# EAGLE design stm32_mather (EAGLE 9.6.2)
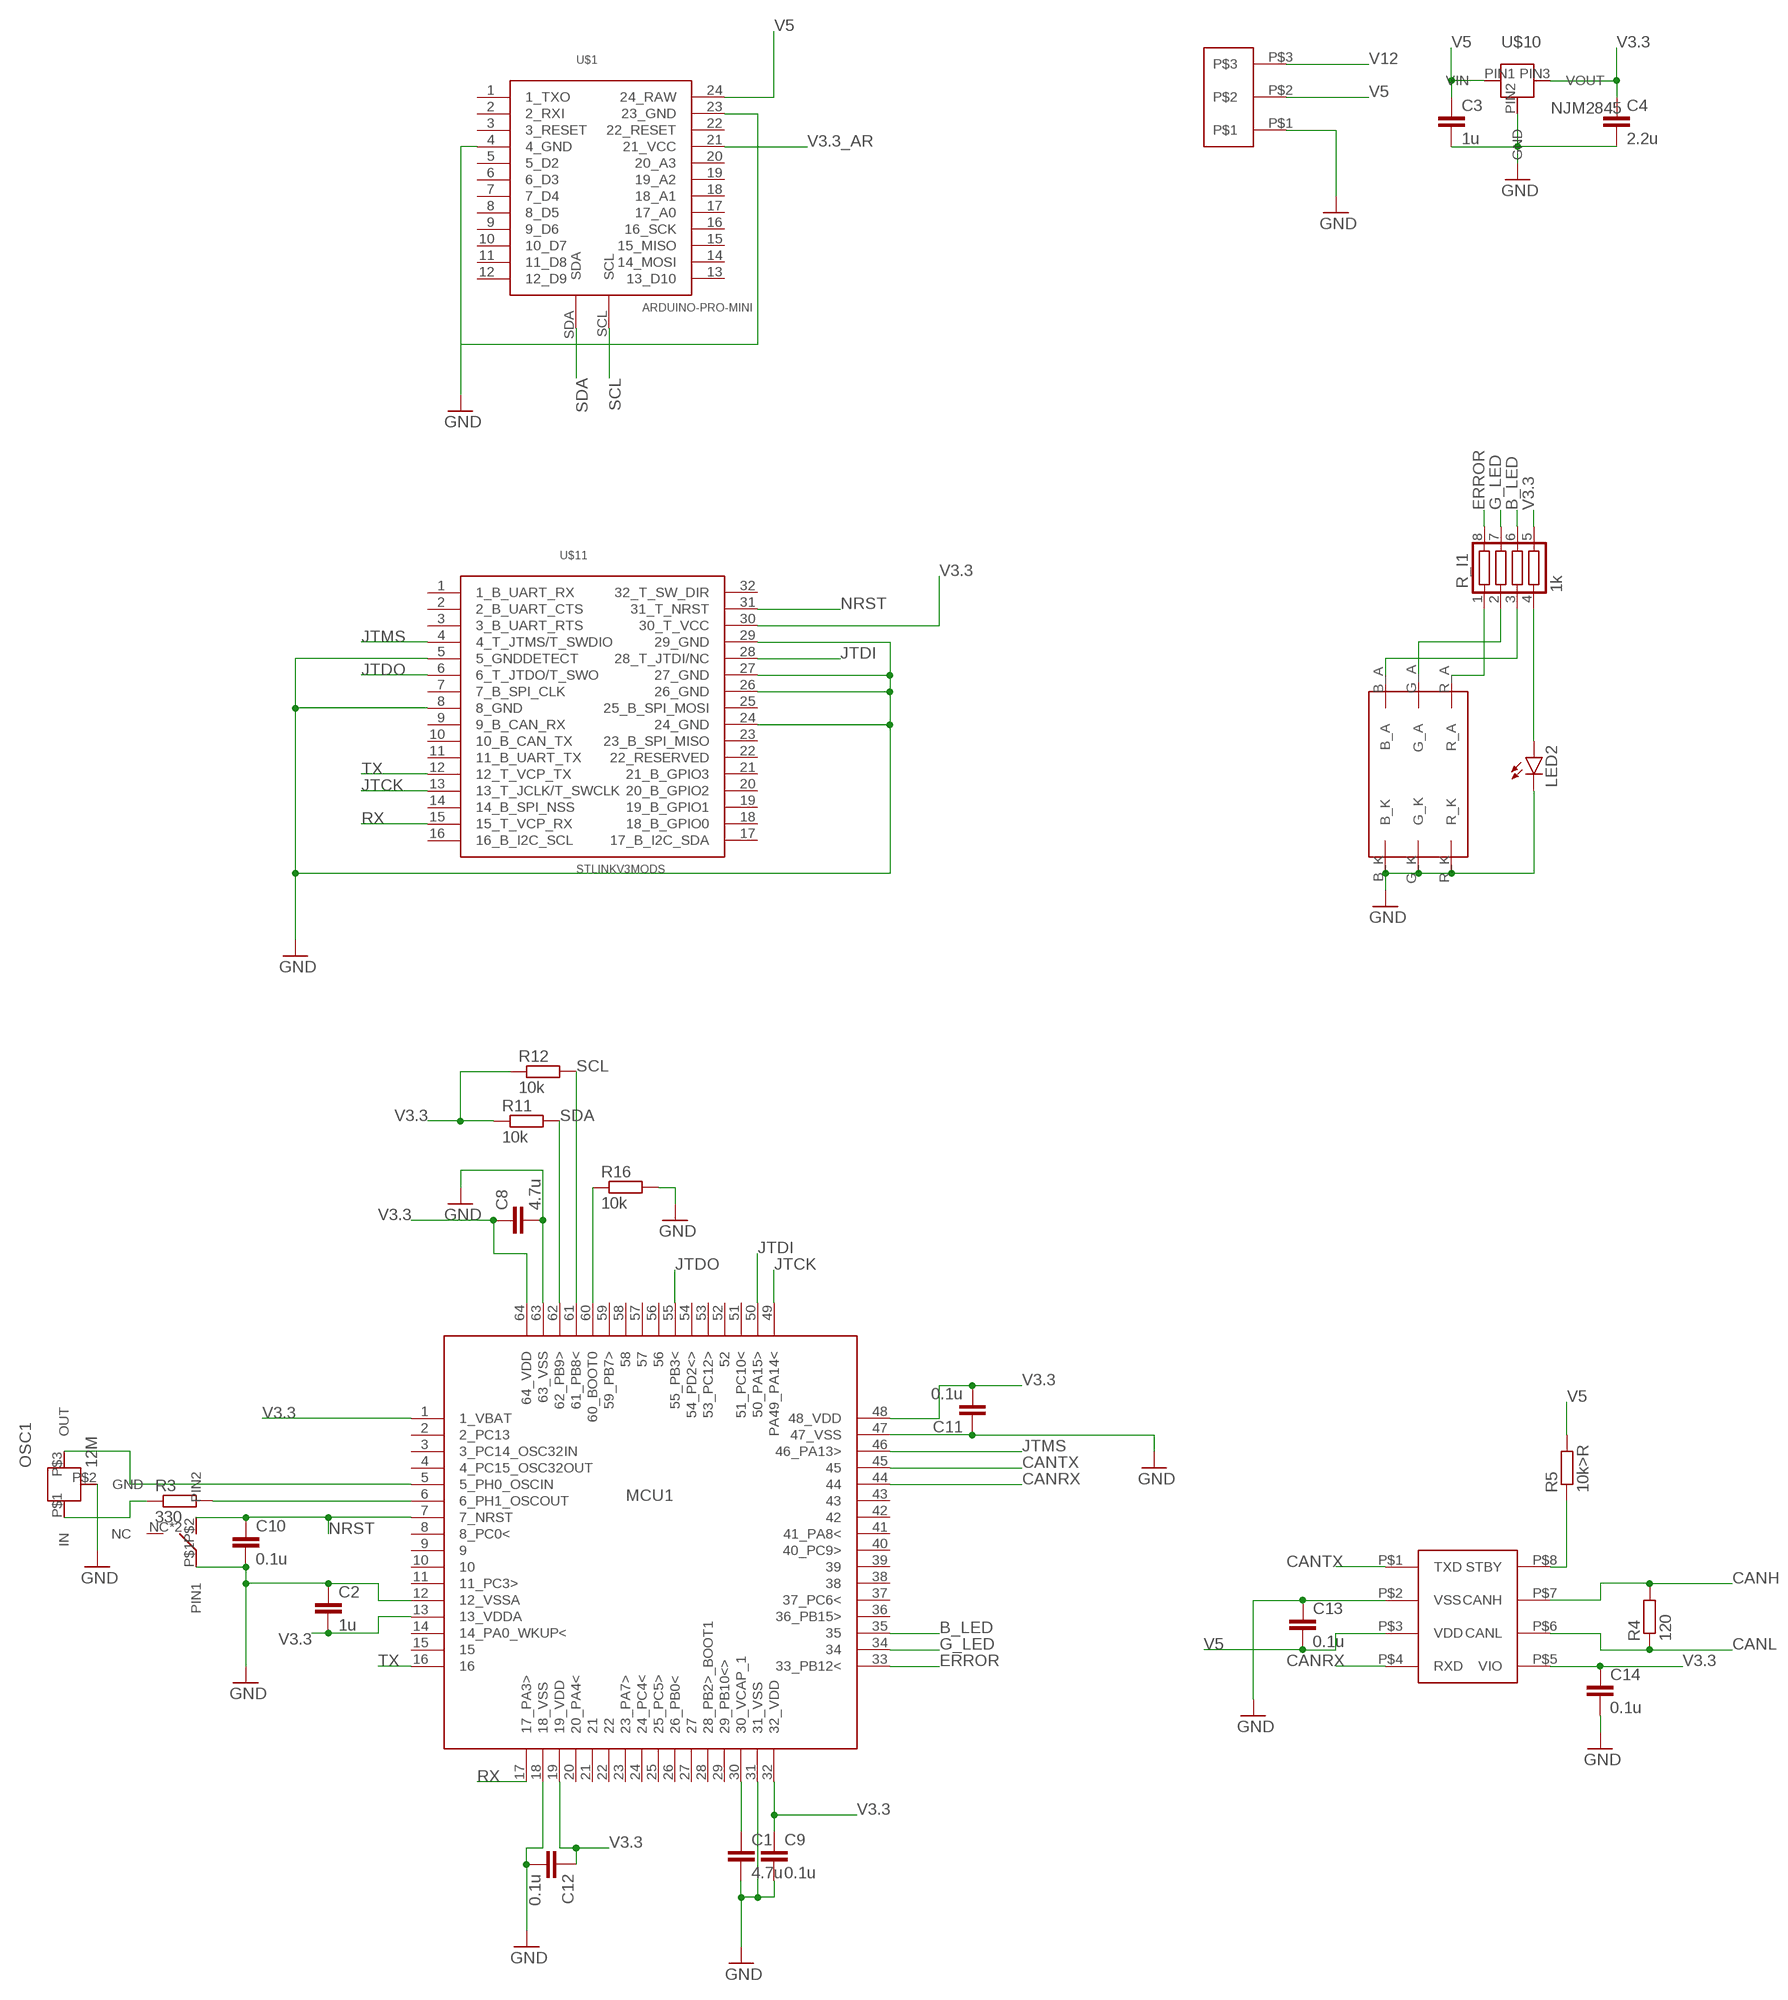
[diagram p0: schematic, sheet 1, part 1 of 2]
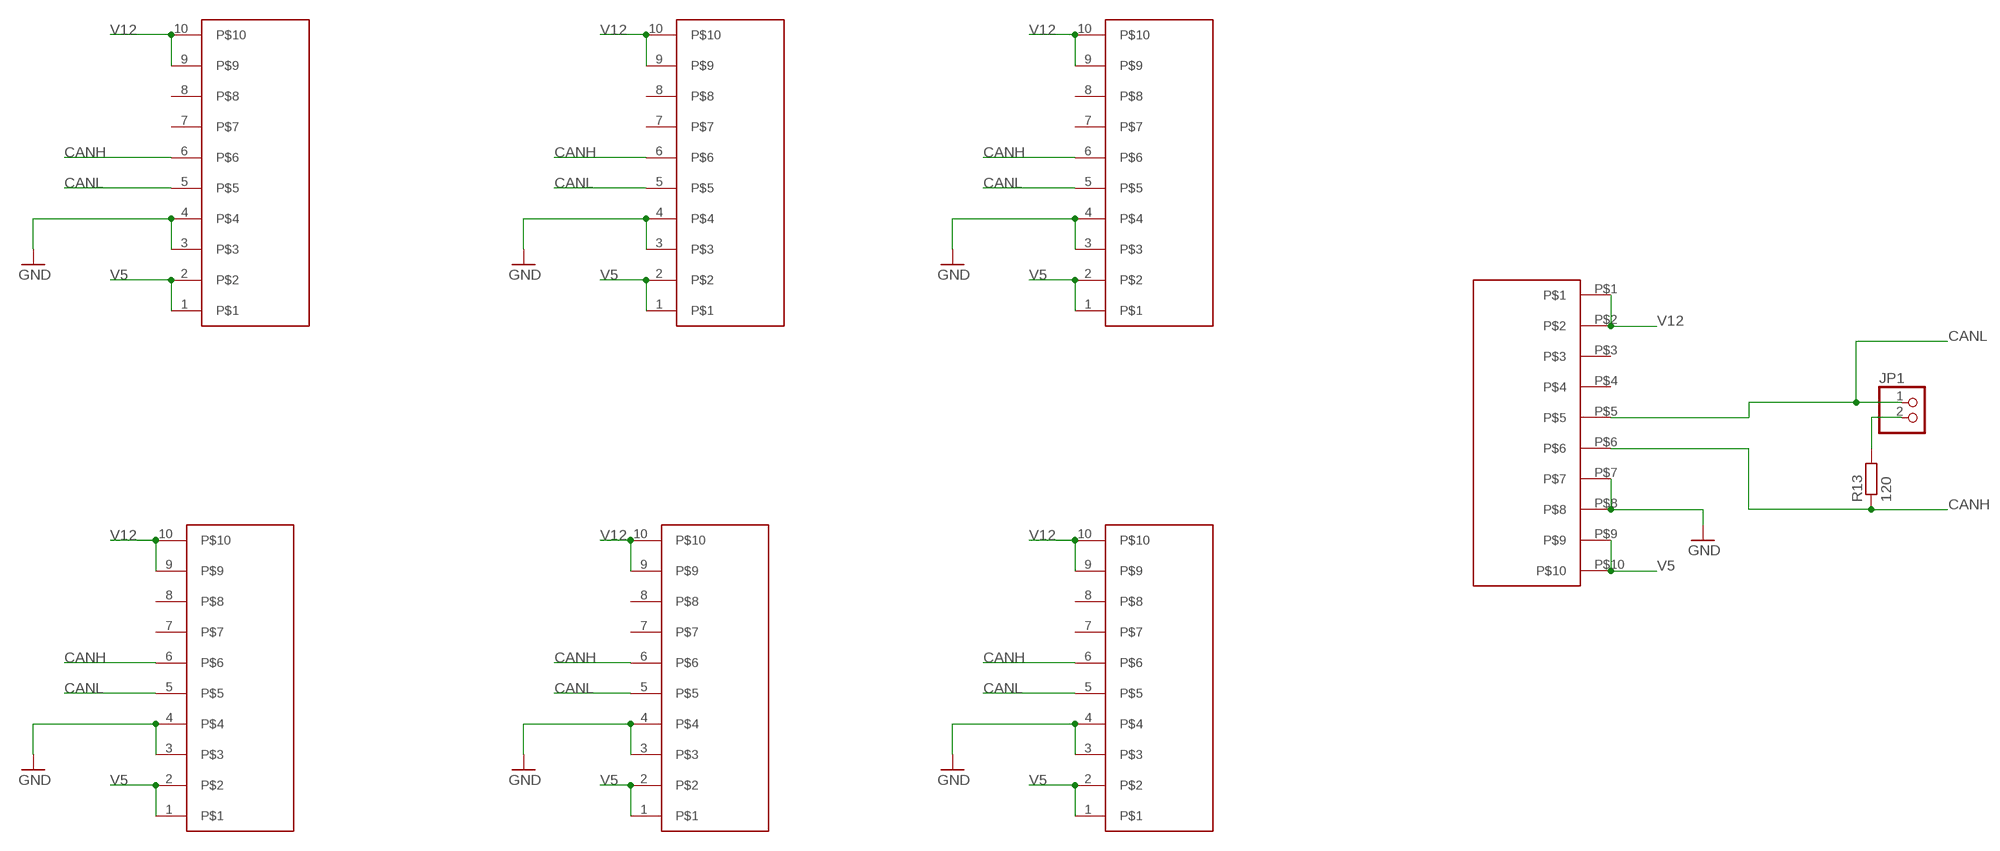
[diagram p1: schematic, sheet 1, part 2 of 2]

## Parts
C1  4.7u  C-EUC1608  [C1608]
C2  1u  C-EUC1608  [C1608]
C3  1u  C-EUC1608  [C1608]
C4  2.2u  C-EUC1608  [C1608]
C8  4.7u  C-EUC1608  [C1608]
C9  0.1u  C-EUC1608  [C1608]
C10  0.1u  C-EUC1608  [C1608]
C11  0.1u  C-EUC1608  [C1608]
C12  0.1u  C-EUC1608  [C1608]
C13  0.1u  C-EUC1608  [C1608]
C14  0.1u  C-EUC1608  [C1608]
JP1  PINHD-1X2  [1X02]
LED2  1608LED  [1608]
MCU1  STM32F446  [LQFP64-2]
OSC1  12M  CSTN#  [CSTNE#]
R3  330  R_REG  [1608]
R4  120  R_REG  [1608]
R5  10k>R  R_REG  [1608]
R11  10k  R_REG  [1608]
R12  10k  R_REG  [1608]
R13  120  R_REG  [1608]
R16  10k  R_REG  [1608]
R_I1  1k  R_SHUGOU  [0603X4RESISTOR]
U$1  ARDUINO-PRO-MINI  [ARDUINO_PRO_MINI]
U$2  BOX10PBOX10PIN-MESU  [BOX10P-MESU]
U$3  BOX10PBOX10PIN-MESU  [BOX10P-MESU]
U$4  BOX10PBOX10PIN-MESU  [BOX10P-MESU]
U$5  BOX10PBOX10PIN-MESU  [BOX10P-MESU]
U$6  BOX10PBOX10PIN-MESU  [BOX10P-MESU]
U$7  BOX10PBOX10PIN-MESU  [BOX10P-MESU]
U$8  BOX10PBOX10P-L  [BOX10P-L]
U$9  YUROBLOCK3  [YUROBLOCK3]
U$10  NJM2845  [TO252]
U$11  STLINKV3MODS  [STLINKV3MODS]
U$12  TAKUTOSUITTI2  [TAKUTOSUITTI2]
U$13  MCP2562MCP2561-SN  [SOIC8]
U$15  RGB_LED  [RGB_LED]

## Nets
B_LED: MCU1.35 R_I1.6
CANH: R4.2 R13.1 U$2.6 U$3.6 U$4.6 U$5.6 U$6.6 U$7.6 U$8.P$6 U$13.P$7(CANH)
CANL: JP1.1 R4.1 U$2.5 U$3.5 U$4.5 U$5.5 U$6.5 U$7.5 U$8.P$5 U$13.P$6(CANL)
CANRX: MCU1.44 U$13.P$4(RXD)
CANTX: MCU1.45 U$13.P$1(TXD)
ERROR: MCU1.33(33_PB12<) R_I1.8
G_LED: MCU1.34 R_I1.7
GND: C1.2 C2.1 C3.2 C4.2 C8.2 C9.2 C10.2 C11.1 C12.2 C13.1 C14.2 LED2.K MCU1.12(12_VSSA) MCU1.18(18_VSS) MCU1.31(31_VSS) MCU1.47(47_VSS) MCU1.63(63_VSS) OSC1.P$2(GND) R16.2 U$1.4(4_GND) U$1.23(23_GND) U$2.3 U$2.4 U$3.3 U$3.4 U$4.3 U$4.4 U$5.3 U$5.4 U$6.3 U$6.4 U$7.3 U$7.4 U$8.P$7 U$8.P$8 U$9.P$1 U$10.PIN2(GND) U$11.5(5_GNDDETECT) U$11.8(8_GND) U$11.24(24_GND) U$11.26(26_GND) U$11.27(27_GND) U$11.29(29_GND) U$12.P$1(PIN1) U$13.P$2(VSS) U$15.B_K U$15.G_K U$15.R_K
JTCK: MCU1.49(PA49_PA14<) U$11.13(13_T_JCLK/T_SWCLK)
JTDI: MCU1.50(50_PA15>) U$11.28(28_T_JTDI/NC)
JTDO: MCU1.55(55_PB3<) U$11.6(6_T_JTDO/T_SWO)
JTMS: MCU1.46(46_PA13>) U$11.4(4_T_JTMS/T_SWDIO)
N$4: C1.1 MCU1.30(30_VCAP_1)
N$6: OSC1.P$1(IN) R3.1
N$10: R_I1.1 U$15.R_A
N$11: MCU1.5(5_PH0_OSCIN) OSC1.P$3(OUT)
N$12: MCU1.6(6_PH1_OSCOUT) R3.2
N$19: R5.1 U$13.P$8(STBY)
N$27: JP1.2 R13.2
N$29: R_I1.2 U$15.G_A
N$31: R_I1.3 U$15.B_A
N$32: LED2.A R_I1.4
N$33: MCU1.60(60_BOOT0) R16.1
NRST: C10.1 MCU1.7(7_NRST) U$11.31(31_T_NRST) U$12.P$2(PIN2)
RX: MCU1.17(17_PA3>) U$11.15(15_T_VCP_RX)
SCL: MCU1.61(61_PB8<) R12.2 U$1.SCL
SDA: MCU1.62(62_PB9>) R11.2 U$1.SDA
TX: MCU1.16 U$11.12(12_T_VCP_TX)
V3.3: C2.2 C4.1 C8.1 C9.1 C11.2 C12.1 C14.1 MCU1.1(1_VBAT) MCU1.13(13_VDDA) MCU1.19(19_VDD) MCU1.32(32_VDD) MCU1.48(48_VDD) MCU1.64(64_VDD) R11.1 R12.1 R_I1.5 U$10.PIN3(VOUT) U$11.30(30_T_VCC) U$13.P$5(VIO)
V3.3_AR: U$1.21(21_VCC)
V5: C3.1 C13.2 R5.2 U$1.24(24_RAW) U$2.1 U$2.2 U$3.1 U$3.2 U$4.1 U$4.2 U$5.1 U$5.2 U$6.1 U$6.2 U$7.1 U$7.2 U$8.P$9 U$8.P$10 U$9.P$2 U$10.PIN1(VIN) U$13.P$3(VDD)
V12: U$2.9 U$2.10 U$3.9 U$3.10 U$4.9 U$4.10 U$5.9 U$5.10 U$6.9 U$6.10 U$7.9 U$7.10 U$8.P$1 U$8.P$2 U$9.P$3
Unconnected: MCU1.2(2_PC13) MCU1.3(3_PC14_OSC32IN) MCU1.4(4_PC15_OSC32OUT) MCU1.8(8_PC0<) MCU1.9 MCU1.10 MCU1.11(11_PC3>) MCU1.14(14_PA0_WKUP<) MCU1.15 MCU1.20(20_PA4<) MCU1.21 MCU1.22 MCU1.23(23_PA7>) MCU1.24(24_PC4<) MCU1.25(25_PC5>) MCU1.26(26_PB0<) MCU1.27 MCU1.28(28_PB2>_BOOT1) MCU1.29(29_PB10<>) MCU1.36(36_PB15>) MCU1.37(37_PC6<) MCU1.38 MCU1.39 MCU1.40(40_PC9>) MCU1.41(41_PA8<) MCU1.42 MCU1.43 MCU1.51(51_PC10<) MCU1.52 MCU1.53(53_PC12>) MCU1.54(54_PD2<>) MCU1.56 MCU1.57 MCU1.58 MCU1.59(59_PB7>) U$1.1(1_TXO) U$1.2(2_RXI) U$1.3(3_RESET) U$1.5(5_D2) U$1.6(6_D3) U$1.7(7_D4) U$1.8(8_D5) U$1.9(9_D6) U$1.10(10_D7) U$1.11(11_D8) U$1.12(12_D9) U$1.13(13_D10) U$1.14(14_MOSI) U$1.15(15_MISO) U$1.16(16_SCK) U$1.17(17_A0) U$1.18(18_A1) U$1.19(19_A2) U$1.20(20_A3) U$1.22(22_RESET) U$2.7 U$2.8 U$3.7 U$3.8 U$4.7 U$4.8 U$5.7 U$5.8 U$6.7 U$6.8 U$7.7 U$7.8 U$8.P$3 U$8.P$4 U$11.1(1_B_UART_RX) U$11.2(2_B_UART_CTS) U$11.3(3_B_UART_RTS) U$11.7(7_B_SPI_CLK) U$11.9(9_B_CAN_RX) U$11.10(10_B_CAN_TX) U$11.11(11_B_UART_TX) U$11.14(14_B_SPI_NSS) U$11.16(16_B_I2C_SCL) U$11.17(17_B_I2C_SDA) U$11.18(18_B_GPIO0) U$11.19(19_B_GPIO1) U$11.20(20_B_GPIO2) U$11.21(21_B_GPIO3) U$11.22(22_RESERVED) U$11.23(23_B_SPI_MISO) U$11.25(25_B_SPI_MOSI) U$11.32(32_T_SW_DIR) U$12.NC U$12.NC@2(NC)

## Library data of the parts
C1-C4 C8-C14 = rcl:C-EU: CAPACITOR, European symbol; SPICEPREFIX: C
JP1 = pinhead:PINHD-1X2: PIN HEADER
LED2 = user_leds:1608LED: 1608LED
MCU1 = user_ic:STM32F446
OSC1 = user_osc:CSTN#: ムラタのセラロック （セラミック振動子） 周波数はいくつか種類あり(valueで設定して) 秋月電子通商のトップ/パーツ一般/発振子/セラミック発振子 uCからのoutが入るのがinであることに注意 https://akizukidenshi.com/catalog/c/cceralock/
R3-R5 R11-R13 R16 = user_rcl:R_REG: 1608パッケージのチップ抵抗 ガッコのリールの抵抗はたぶんこれ
R_I1 = user_rcl:R_SHUGOU
U$1 = user_ic:ARDUINO-PRO-MINI: アルデュイーノプロミニ 上側の横向きの入るヘッダ用の穴は省略 多分基板に差し込むための穴ではなくてほかのシールドと連結するための穴であるから、フットプリント上に穴は必要ないと判断した。 なんか内側にあるi2cの信号の部分が糞of糞、組み込み設計者に喧嘩売ってるレベル
U$2-U$8 = user_conector:BOX10P
U$9 = user_conector:YUROBLOCK3
U$10 = user_ic:NJM2845: 3.3V800mA NJM2845 低ドロップアウト三端子レギュレータ 秋月電子通商[I-11299]
U$11 = user_ic:STLINKV3MODS: STlinkV3mods stlinkv3miniを基板上につけられるようにしたデバッグモジュール digikey[497-STLINK-V3MODS-ND] B = Bridge RESERVED = 予約済みのピン、利用不可
U$12 = user_swich:TAKUTOSUITTI2: 表面実装タクトスイッチ 秋月電子通称通販コード[P-14888]
U$13 = user_ic:MCP2562
U$15 = user_leds:RGB_LED: 秋月電子通商 I-12726

## Board
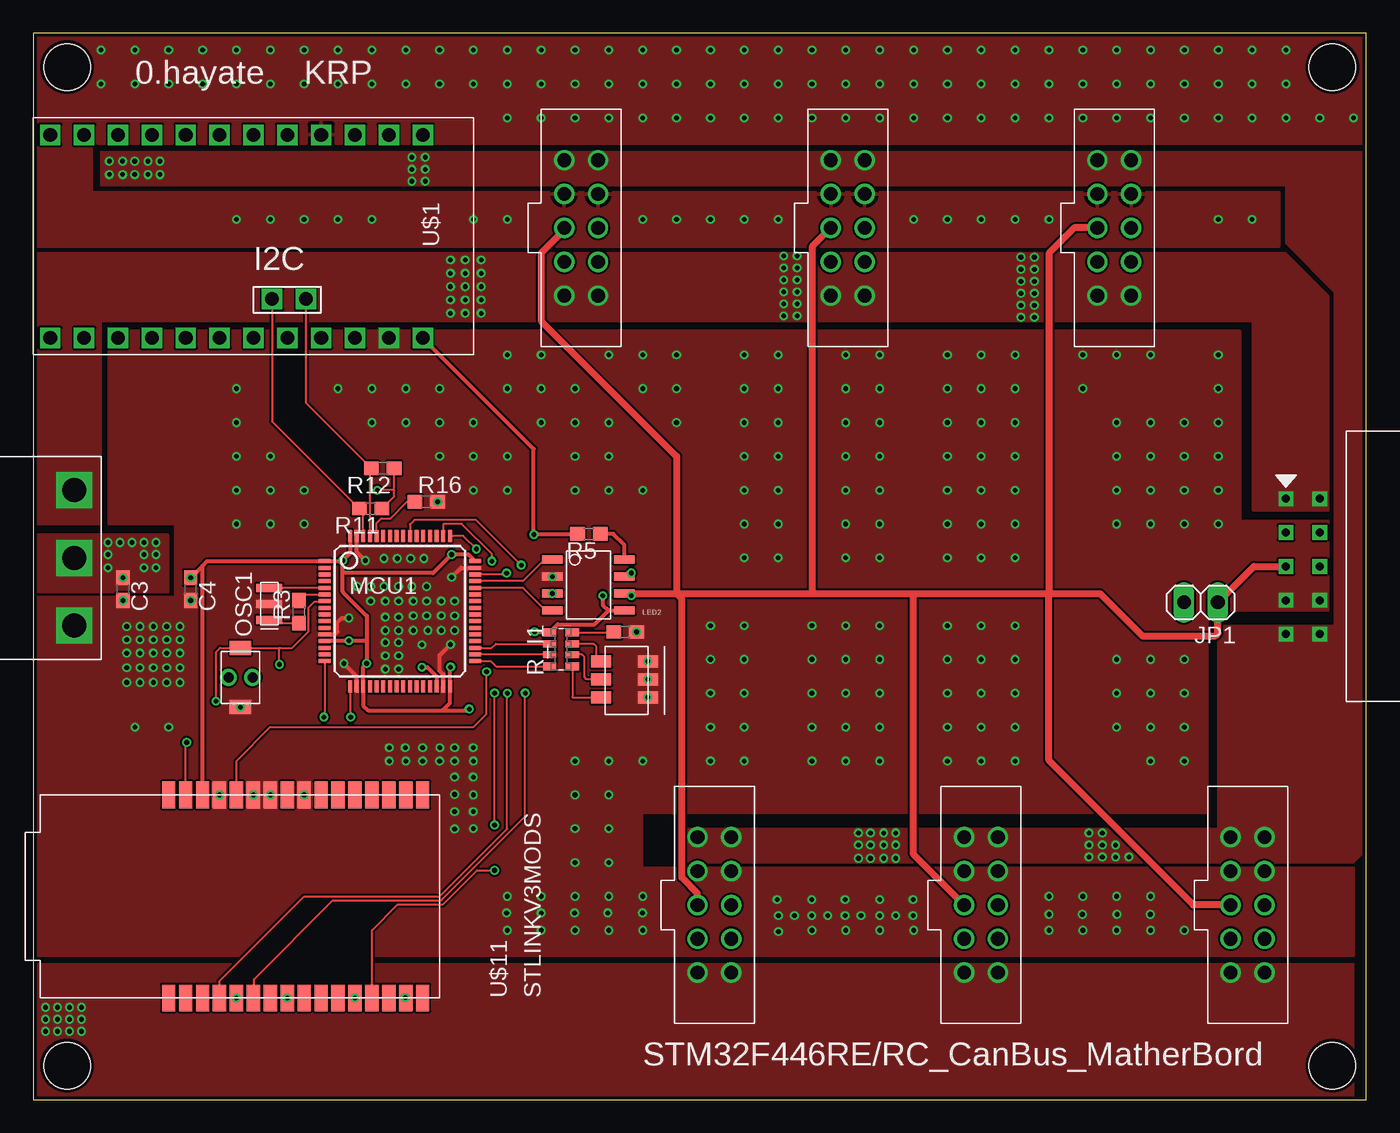
[diagram p2: board, top side]
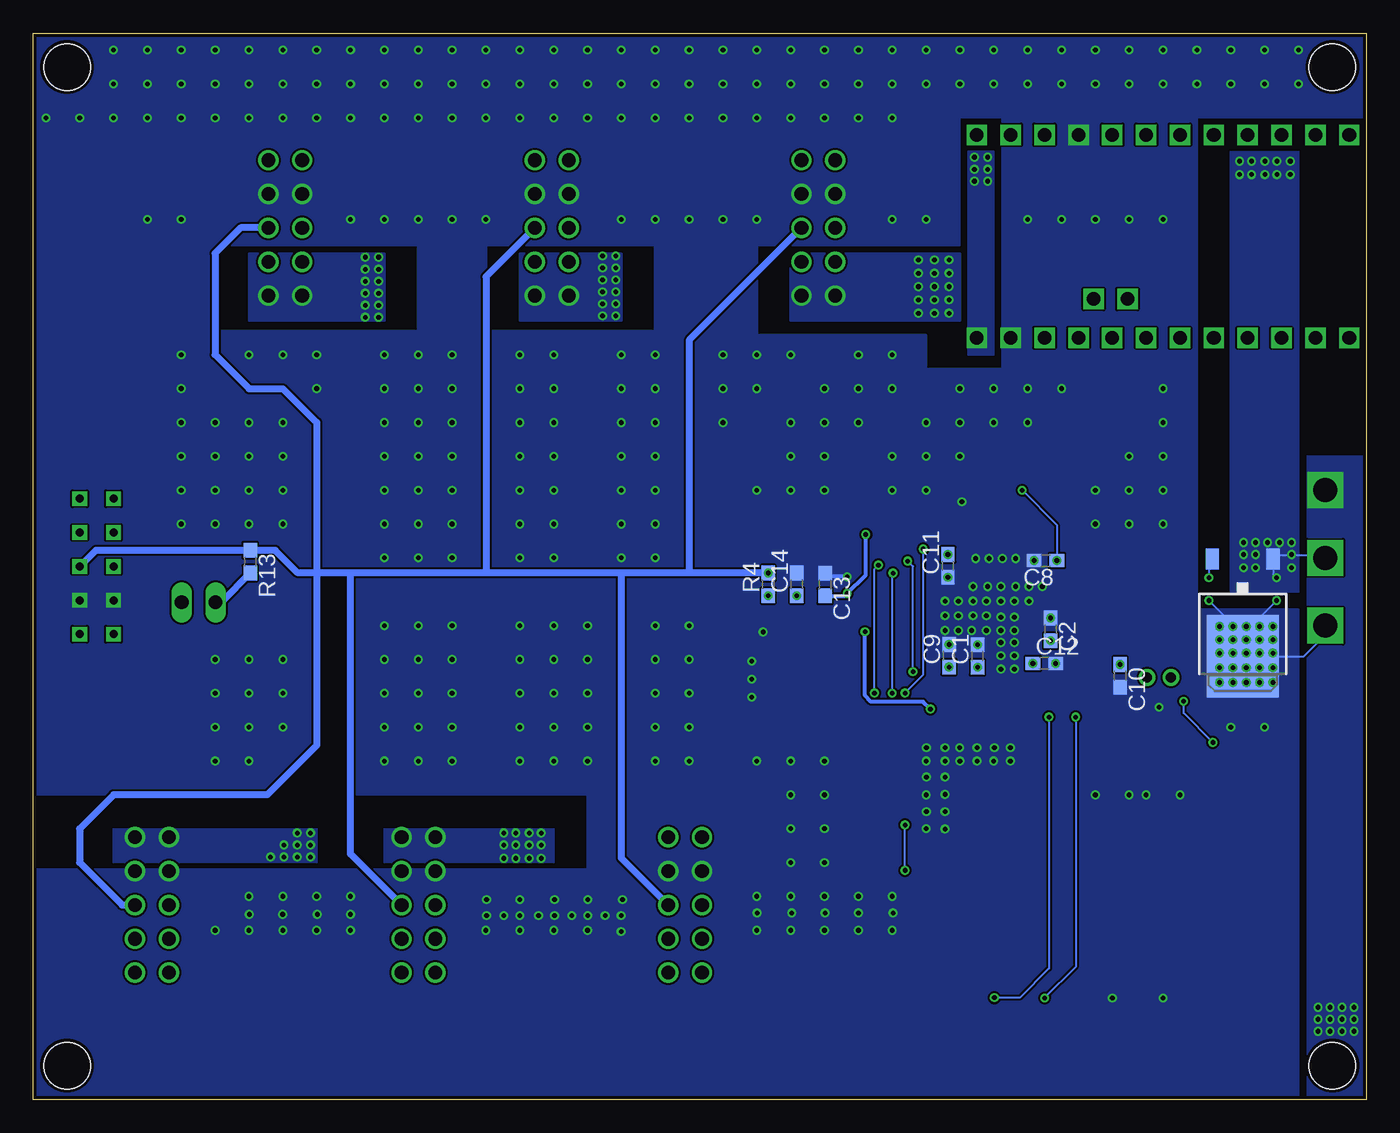
[diagram p3: board, bottom side, seen from below]

Size 100 x 80 mm. Coordinates in mm from the lower left corner, seen from the top.
Outline: 0,0 100,0 100,80 0,80 0,0
Copper layers (1*16): Top 0.035mm / dielectric 1.5mm / Bottom 0.035mm
Design rules "SeeedStudio_2layer_DRU_no_angle_20140221": minimum track width 6mil, minimum drill 12mil, track to track 6mil, track to pad 6mil, pad to pad 6mil, via to via 6mil, smd to smd 0mil, copper to edge 10mil, drill to drill 10mil, minimum pad ring 10mil, minimum via ring 6mil, stop-mask expansion 2mil, vias tented up to drill 100mil, thermal gap 10mil
Holes 3.5 mm at 2.54,2.54 97.46,2.54 97.46,77.46 2.54,77.46

### Footprints (pad centres in the part's own frame; a part is rotated, then mirrored left to right if it is on the bottom)
C1608 = smd 1.1 x 1: 1 -0.85,0; 2 0.85,0
1X02 = drill 1.016 long: 1 -1.27,0; 2 1.27,0
1608 = smd 1.1 x 1: A -0.85,0; K 0.85,0
LQFP64-2 = smd 0.9 x 0.3: 1 -5.65,3.75; 2 -5.65,3.25; 3 -5.65,2.75; 4 -5.65,2.25; 5 -5.65,1.75; 6 -5.65,1.25; 7 -5.65,0.75; 8 -5.65,0.25; 9 -5.65,-0.25; 10 -5.65,-0.75; 11 -5.65,-1.25; 12 -5.65,-1.75; 13 -5.65,-2.25; 14 -5.65,-2.75; 15 -5.65,-3.25; 16 -5.65,-3.75; 33 5.65,-3.75; 34 5.65,-3.25; 35 5.65,-2.75; 36 5.65,-2.25; 37 5.65,-1.75; 38 5.65,-1.25; 39 5.65,-0.75; 40 5.65,-0.25; 41 5.65,0.25; 42 5.65,0.75; 43 5.65,1.25; 44 5.65,1.75; 45 5.65,2.25; 46 5.65,2.75; 47 5.65,3.25; 48 5.65,3.75 | smd 0.3 x 0.9: 17 -3.75,-5.65; 18 -3.25,-5.65; 19 -2.75,-5.65; 20 -2.25,-5.65; 21 -1.75,-5.65; 22 -1.25,-5.65; 23 -0.75,-5.65; 24 -0.25,-5.65; 25 0.25,-5.65; 26 0.75,-5.65; 27 1.25,-5.65; 28 1.75,-5.65; 29 2.25,-5.65; 30 2.75,-5.65; 31 3.25,-5.65; 32 3.75,-5.65; 49 3.75,5.65; 50 3.25,5.65; 51 2.75,5.65; 52 2.25,5.65; 53 1.75,5.65; 54 1.25,5.65; 55 0.75,5.65; 56 0.25,5.65; 57 -0.25,5.65; 58 -0.75,5.65; 59 -1.25,5.65; 60 -1.75,5.65; 61 -2.25,5.65; 62 -2.75,5.65; 63 -3.25,5.65; 64 -3.75,5.65
CSTNE# = smd 0.6 x 1.95: P$1 0,0; P$2 1.2,0; P$3 2.4,0
1608' = smd 1.1 x 1: 1 -0.85,0; 2 0.85,0
0603X4RESISTOR = smd 0.6 x 1: 1 -1.275,-0.85; 4 1.275,-0.85; 5 1.275,0.85; 8 -1.275,0.85 | smd 0.5 x 1: 2 -0.4,-0.85; 3 0.4,-0.85; 6 0.4,0.85; 7 -0.4,0.85
ARDUINO_PRO_MINI = drill 1.02 square: 1 -7.62,13.97; 2 -7.62,11.43; 3 -7.62,8.89; 4 -7.62,6.35; 5 -7.62,3.81; 6 -7.62,1.27; 7 -7.62,-1.27; 8 -7.62,-3.81; 9 -7.62,-6.35; 10 -7.62,-8.89; 11 -7.62,-11.43; 12 -7.62,-13.97; 13 7.62,-13.97; 14 7.62,-11.43; 15 7.62,-8.89; 16 7.62,-6.35; 17 7.62,-3.81; 18 7.62,-1.27; 19 7.62,1.27; 20 7.62,3.81; 21 7.62,6.35; 22 7.62,8.89; 23 7.62,11.43; 24 7.62,13.97; SCL 4.699,5.207; SDA 4.699,2.667
BOX10P-MESU = drill 1.02: 1 -5.08,1.73; 2 -5.08,4.27; 3 -2.54,1.73; 4 -2.54,4.27; 5 0,1.73; 6 0,4.27; 7 2.54,1.73; 8 2.54,4.27; 9 5.08,1.73; 10 5.08,4.27
BOX10P-L = drill 0.6 square: P$1 5.08,2.54; P$2 5.08,0; P$3 2.54,2.54; P$4 2.54,0; P$5 0,2.54; P$6 0,0; P$7 -2.54,2.54; P$8 -2.54,0; P$9 -5.08,2.54; P$10 -5.08,0
YUROBLOCK3 = drill 1.8 square: P$1 2,12.7; P$2 2,7.62; P$3 2,2.54
TO252 = smd 1 x 1.6: PIN1 -2.28,-4.8; PIN3 2.28,-4.8 | smd 5.4 x 6.2: PIN2 0,2.5
STLINKV3MODS = smd 2 x 1: 1 0,20.32; 2 0,19.05; 3 0,17.78; 4 0,16.51; 5 0,15.24; 6 0,13.97; 7 0,12.7; 8 0,11.43; 9 0,10.16; 10 0,8.89; 11 0,7.62; 12 0,6.35; 13 0,5.08; 14 0,3.81; 15 0,2.54; 16 0,1.27; 17 15.24,1.27; 18 15.24,2.54; 19 15.24,3.81; 20 15.24,5.08; 21 15.24,6.35; 22 15.24,7.62; 23 15.24,8.89; 24 15.24,10.16; 25 15.24,11.43; 26 15.24,12.7; 27 15.24,13.97; 28 15.24,15.24; 29 15.24,16.51; 30 15.24,17.78; 31 15.24,19.05; 32 15.24,20.32
TAKUTOSUITTI2 = drill 0.75: NC 2.225,-0.9; NC@2 2.225,0.9 | smd 1.05 x 1.6: P$1 0,0; P$2 4.45,0
SOIC8 = smd 1.55 x 0.6: P$1 -2.7,1.905; P$2 -2.7,0.635; P$3 -2.7,-0.635; P$4 -2.7,-1.905; P$5 2.7,-1.905; P$6 2.7,-0.635; P$7 2.7,0.635; P$8 2.7,1.905
RGB_LED = smd 1.5 x 0.9: B_A 3.5,-2.7; B_K 0,-2.7; G_A 3.5,-1.35; G_K 0,-1.35; R_A 3.5,0; R_K 0,0

### Placement (x,y rotation side)
C1  29.16,33.28 90 bottom
C2  23.68,35.28 270 bottom
C3  6.72,38.3 270 top
C4  11.8,38.3 270 top
C8  24.06,40.44 180 bottom
C9  31.3,33.3 90 bottom
C10  18.46,31.8 270 bottom
C11  31.38,40.04 90 bottom
C12  24.16,32.72 0 bottom
C13  40.6,38.64 270 bottom
C14  42.72,38.66 90 bottom
JP1  87.6,37.3 180 top
LED2  44.4,35.08 0 top
MCU1  27.5,36.64 0 top
OSC1  17.7,36 90 top
R3  330  [1608']  19.92,36.6 90 top
R4  120  [1608']  44.86,38.66 90 bottom
R5  10k>R  [1608']  41.68,42.44 180 top
R11  10k  [1608']  25.3,44.34 180 top
R12  10k  [1608']  26.22,47.36 180 top
R13  120  [1608']  83.72,40.36 270 bottom
R16  10k  [1608']  29.48,44.84 0 top
R_I1  39.58,33.78 90 top
U$1  15.24,64.77 270 top
U$2  38.1,65.4 270 top
U$3  48.1,14.6 270 top
U$4  58.1,65.4 270 top
U$5  68.1,14.6 270 top
U$6  78.1,65.4 270 top
U$7  88.1,14.6 270 top
U$8  96.52,40 90 top
U$9  5.08,48.26 180 top
U$10  9.26,35.76 180 bottom
U$11  30.48,7.62 90 top
U$12  15.54,29.44 90 top
U$13  41.64,38.6 0 top
U$15  46.1,30.18 180 top

### Tracks (layer width: path | path; a pad name or v marks a point on that pad's centre or on a via)
B_LED
  Top 0.152: MCU1.35 34.39,33.89 34.7,34.2 38.71,34.2 R_I1.6
CANH  (via drill 0.35)
  Top 0.305: U$13.P$7 44.62,39.51 R4.2
  Bottom 0.508: R4.2 50.8,39.51 | 50.8,39.51 55.88,39.51 | 55.88,39.51 66.04,39.51 | 66.04,39.51 76.2,39.51 | 76.2,39.51 78.74,39.51 | 78.74,39.51 80.15,39.51 81.85,41.21 R13.1 95.31,41.21 U$8.P$6 | U$5.6 76.2,18.43 76.2,39.51 | U$3.6 55.88,18.11 55.88,39.51 | 78.74,39.51 78.74,26.57 82.45,22.86 93.98,22.86 96.52,20.32 96.52,17.78 93.34,14.6 U$7.6 | U$4.6 66.04,61.73 66.04,39.51 | U$2.6 50.8,56.97 50.8,39.51 | U$6.6 84.46,65.4 86.36,63.5 86.36,55.88 83.82,53.34 81.28,53.34 78.74,50.8 78.74,39.51
  other vias: 44.86,39.51
CANL  (via drill 0.35)
  Top 0.305: U$13.P$6 44.7,37.97 R4.1
  Top 0.508: U$13.P$6 48.26,37.97 | 48.26,37.97 58.42,37.97 | 58.42,37.97 66.04,37.97 | 66.04,37.97 76.2,37.97 | 76.2,37.97 80.03,37.97 83.2,34.8 88.7,34.8 88.87,34.97 JP1.1 91.57,40 U$8.P$5 | U$5.5 66.04,18.39 66.04,37.97 | U$2.5 39.83,65.23 38.1,63.5 38.1,58.42 48.26,48.26 48.26,37.97 | U$4.5 58.42,63.99 58.42,37.97 | U$3.5 49.83,15.48 48.66,16.66 48.66,37.57 48.26,37.97 | U$7.5 87.03,14.6 76.2,25.43 76.2,37.97 | U$6.5 78.1,65.4 76.2,63.5 76.2,37.97
  other vias: 44.86,37.81
CANRX
  Top 0.152: U$13.P$4 38.45,36.7 36.75,38.39 MCU1.44
CANTX
  Top 0.152: U$13.P$1 38.34,40.51 36.73,38.89 MCU1.45
ERROR
  Top 0.152: MCU1.33 34.31,32.89 34.7,32.5 R_I1.8
G_LED
  Top 0.152: R_I1.7 MCU1.34
GND  (via drill 0.35)
  Top 0.305: C8.2 24.25,41.1 MCU1.63 | MCU1.31 30.75,31.9 30.48,32.17 30.48,33.33 C9.2 | C11.1 32.08,39.89 MCU1.47 | MCU1.12 22.59,34.89 22.8,35.1 22.8,35.8 23.13,36.13 C2.1 | MCU1.18 24.25,31.75 23.31,32.69 C12.2
  Bottom 0.152: U$9.P$1 3.08,34.86 4.68,33.26 U$10.PIN2 9.26,34.91 | C4.2 9.26,34.91 | C3.2 9.26,34.91
  Bottom 0.305: U$13.P$2 40.34,39.23 C13.1
  other vias: 11.8,37.45 6.72,37.45 15.54,29.44 23.68,36.13 23.31,32.72 31.3,34.15 29.16,34.13 24.91,40.44 31.38,39.19 45.25,35.08 46.1,32.88 46.1,31.53 46.1,30.18 38.94,39.23 19.05,7.62 15.24,7.62 20.32,22.86 17.78,22.86 16.51,22.86 13.97,22.86 30.33,44.84 7,35.5 8,35.5 9,35.5 10,35.5 11,35.5 11,34.5 10,34.5 9,34.5 8,34.5 7,34.5 7,33.5 8,33.5 9,33.5 10,33.5 11,33.5 11,32.4 10,32.4 9,32.4 8,32.4 7,32.4 7,31.3 8,31.3 9,31.3 10,31.3 11,31.3 26.3,40.6 27.3,40.6 28.3,40.6 29.3,40.6 29.5,38.5 28.4,38.5 27.4,38.5 26.3,38.5 25.3,38.5 24.3,38.5 25.3,37.4 26.4,37.4 27.4,37.4 28.5,37.4 29.5,37.4 30.6,37.4 31.6,37.4 31.6,36.3 31.6,35.2 30.6,35.2 30.6,36.3 29.5,36.3 29.6,35.2 28.5,35.2 28.5,36.3 27.4,36.2 26.4,36.2 26.4,35.2 27.4,35.2 27.4,34.3 26.4,34.3 27.4,33.3 27.4,32.3 26.4,32.3 26.4,33.3 7.62,27.94 10.16,27.94 26.7,26.4 26.7,25.4 27.9,26.4 27.94,25.4 29.2,26.4 29.2,25.4 30.5,26.4 30.48,25.4 31.6,26.4 31.6,25.4 33,26.4 33.02,25.4 31.6,24.2 33,24.2 31.6,22.9 33.02,22.86 31.6,21.6 33,21.6 33.02,20.32 31.6,20.3 35.56,12.7 35.5,14 35.56,15.24 38.1,12.7 38.1,14 38.1,15.24 40.64,12.7 40.6,14 40.64,15.24 43.18,15.24 43.1,14 43.18,12.7 45.72,12.7 45.7,14 45.72,15.24 43.18,17.78 40.64,17.78 40.64,20.32 43.18,20.32 43.18,22.86 40.64,22.86 40.64,25.4 43.18,25.4 45.72,25.4 55.8,15 57.1,13.8 55.9,12.6 55.9,13.8 58.42,12.7 58.4,13.8 58.4,15 59.6,13.8 60.96,12.7 60.9,13.8 60.9,15 62.1,13.8 63.5,12.7 63.5,13.8 63.5,15 64.7,13.8 66.04,12.7 66,13.8 66,15 76.2,12.7 76.2,13.9 76.2,15.24 78.74,15.24 78.7,13.9 78.74,12.7 81.28,12.7 81.3,13.9 81.28,15.24 83.82,15.24 83.8,13.9 83.82,12.7 86.36,12.7 15.24,43.18 17.78,43.18 20.32,43.18 20.32,45.72 17.78,45.72 15.24,45.72 17.78,48.26 15.24,48.26 15.24,50.8 15.24,53.34 22.86,53.34 25.4,53.34 27.94,53.34 25.4,50.8 27.94,50.8 30.48,48.26 33.02,45.72 35.56,45.72 35.56,48.26 33.02,48.26 33.02,50.8 30.48,50.8 30.48,53.34 35.56,53.34 38.1,53.34 40.64,53.34 38.1,50.8 40.64,50.8 43.18,50.8 43.18,48.26 40.64,48.26 40.64,45.72 43.18,45.72 45.72,45.72 35.56,55.88 38.1,55.88 81.28,43.18 83.82,43.18 86.36,43.18 88.9,43.18 88.9,45.72 86.36,45.72 83.82,45.72 81.28,45.72 81.28,48.26 83.82,48.26 86.36,48.26 88.9,48.26 88.9,50.8 86.36,50.8 83.82,50.8 81.28,50.8 43.18,55.88 45.72,55.88 48.26,55.88 45.72,53.34 48.26,53.34 48.26,50.8 50.8,35.56 53.34,35.56 53.34,33.02 50.8,33.02 50.8,30.48 53.34,30.48 53.34,27.94 53.34,25.4 50.8,25.4 50.8,27.94 58.42,25.4 60.96,25.4 63.5,25.4 63.5,27.94 60.96,27.94 58.42,27.94 58.42,30.48 60.96,30.48 63.5,30.48 63.5,33.02 60.96,33.02 58.42,33.02 58.42,35.56 60.96,35.56 63.5,35.56 68.58,25.4 71.12,25.4 73.66,25.4 73.66,27.94 71.12,27.94 68.58,27.94 68.58,30.48 71.12,30.48 73.66,30.48 71.12,33.02 73.66,33.02 68.58,33.02 68.58,35.56 71.12,35.56 73.66,35.56 53.34,55.88 55.88,55.88 53.34,53.34 55.88,53.34 53.34,50.8 55.88,50.8 55.88,48.26 53.34,48.26 53.34,45.72 55.88,45.72 53.34,43.18 55.88,43.18 55.88,40.64 53.34,40.64 60.96,55.88 63.5,55.88 68.58,55.88 71.12,55.88 73.66,55.88 78.74,55.88 81.28,55.88 83.82,55.88 78.74,53.34 68.58,53.34 71.12,53.34 73.66,53.34 73.66,50.8 71.12,50.8 68.58,50.8 68.58,48.26 71.12,48.26 73.66,48.26 73.66,45.72 71.12,45.72 68.58,45.72 68.58,43.18 71.12,43.18 73.66,43.18 73.66,40.64 71.12,40.64 68.58,40.64 63.5,40.64 60.96,40.64 60.96,43.18 63.5,43.18 63.5,45.72 60.96,45.72 63.5,48.26 60.96,48.26 63.5,50.8 60.96,50.8 63.5,53.34 60.96,53.34 88.9,53.34 88.9,55.88 15.24,66.04 17.78,66.04 20.32,66.04 22.86,66.04 25.4,66.04 33.02,66.04 35.56,66.04 48.26,66.04 50.8,66.04 55.88,66.04 53.34,66.04 45.72,66.04 66.04,66.04 68.58,66.04 71.12,66.04 73.66,66.04 76.2,66.04 88.9,66.04 91.44,66.04 99.06,73.66 96.52,73.66 93.98,73.66 93.98,76.2 93.98,78.74 91.44,78.74 91.44,76.2 91.44,73.66 88.9,73.66 88.9,76.2 88.9,78.74 86.36,73.66 86.36,76.2 86.36,78.74 83.82,73.66 83.82,76.2 83.82,78.74 81.28,78.74 81.28,76.2 81.28,73.66 78.74,73.66 78.74,76.2 78.74,78.74 76.2,78.74 76.2,76.2 76.2,73.66 73.66,73.66 73.66,76.2 73.66,78.74 71.12,78.74 71.12,76.2 71.12,73.66 68.58,73.66 68.58,76.2 68.58,78.74 66.04,78.74 66.04,76.2 66.04,73.66 63.5,73.66 63.5,76.2 63.5,78.74 60.96,78.74 60.96,76.2 60.96,73.66 58.42,73.66 58.42,76.2 58.42,78.74 55.88,78.74 55.88,76.2 55.88,73.66 53.34,73.66 53.34,76.2 53.34,78.74 50.8,78.74 50.8,76.2 50.8,73.66 48.26,73.66 48.26,76.2 48.26,78.74 45.72,78.74 45.72,76.2 45.72,73.66 43.18,73.66 40.64,73.66 43.18,76.2 43.18,78.74 40.64,78.74 40.64,76.2 38.1,73.66 38.1,76.2 38.1,78.74 35.56,73.66 35.56,76.2 35.56,78.74 33.02,76.2 33.02,78.74 30.48,78.74 30.48,76.2 27.94,76.2 27.94,78.74 25.4,78.74 25.4,76.2 22.86,76.2 22.86,78.74 20.32,78.74 20.32,76.2 17.78,76.2 17.78,78.74 15.24,78.74 15.24,76.2 12.7,76.2 12.7,78.74 10.16,78.74 10.16,76.2 7.62,76.2 7.62,78.74 5.08,78.74 5.08,76.2 83.82,25.4 86.36,25.4 86.36,27.94 83.82,27.94 81.28,27.94 81.28,30.48 83.82,30.48 86.36,30.48 86.36,33.02 83.82,33.02 81.28,33.02
  pour Top (no thermals): 0,27.94 12.7,27.94 12.7,37.7 0.3,37.7 0,37.7
  pour Bottom (no thermals): 5.08,30.48 5.08,0 58.42,0 58.42,22.86 101.6,22.86 101.6,81.28 86.36,81.28 86.36,57.7 71.12,57.7 71.12,81.28 66.04,81.28 66.04,57.68 53.34,57.68 53.34,81.28 45.72,81.28 45.72,57.38 33.02,57.38 33.02,54.86 27.3,54.86 27.3,81.3 27.28,81.28 0,81.28 0,73.66 12.7,73.66 12.7,36.8 5.1,36.8 5.1,30.5
  pour Bottom (no thermals): 25.4,81.28 101.6,81.28 101.6,64.1 30.5,64.1 30.5,73.6 30.6,73.7 25.4,73.7 25.2,73.9 25.2,81.08
  pour Bottom (no thermals): 55.88,0 99.06,0 101.6,0 101.6,17.3 55.9,17.3 55.9,0.02
  pour Top (no thermals): 0,27.94 0,10.8 99.1,10.8 99.1,17.4 45.7,17.4 45.7,21.5 88.1,21.5 88.1,36.7 97.2,36.7 97.2,43.4 90.6,43.4 90.6,57.6 90.5,57.7 5.6,57.7 5.6,43.2 10.6,43.2 10.6,27.9 0.04,27.9
  pour Top: 93.5,68.1 4.4,68.1 4.4,71.7 99.7,71.7 99.7,79.7 0.4,79.7 0.3,79.7 0.3,64 93.5,64
JTCK  (via drill 0.35)
  Top 0.152: U$11.13 25.4,12.7 27.33,14.63 30.73,14.63 33.3,17.2 v34.6,17.2 | v34.6,20.6 v34.6,30.5 | v33.24,41.31 32.26,42.29 MCU1.49
  Bottom 0.152: v34.6,17.2 v34.6,20.6 | v34.6,30.5 33.24,31.86 v33.24,41.31
JTDI  (via drill 0.35)
  Top 0.152: U$11.28 15.24,25.4 17.78,27.94 33.02,27.94 34,28.92 v34,32.1 | v34.4,40.4 34.4,40.93 32.14,43.2 30.8,43.2 30.75,43.15 MCU1.50
  Bottom 0.152: v34,32.1 34,40 v34.4,40.4
JTDO  (via drill 0.35)
  Top 0.152: U$11.6 16.55,7.66 16.55,9.04 22.45,14.94 30.61,14.94 36.9,21.23 v36.9,30.5 | v36.6,40.1 33.2,43.5 28.6,43.5 28.25,43.15 MCU1.55
  Bottom 0.152: v36.9,30.5 36.9,39.8 v36.6,40.1
JTMS  (via drill 0.35)
  Top 0.152: U$11.4 13.97,8.89 20.32,15.24 30.48,15.24 35.56,20.32 v35.56,30.48 | v35.5,39.5 35.39,39.39 MCU1.46
  Bottom 0.152: v35.56,30.48 35.56,39.44 v35.5,39.5
N$4  (via drill 0.35)
  Top 0.305: C1.1 29.57,32.43 30.25,31.75 MCU1.30
  other vias: 29.16,32.43
N$6
  Top 0.152: OSC1.P$1 17.95,35.75 R3.1
N$10
  Top 0.152: R_I1.1 40.44,32.49 40.44,30.2 40.46,30.18 U$15.R_A
N$11
  Top 0.152: MCU1.5 OSC1.P$3
N$12
  Top 0.152: R3.2 20.36,37.89 MCU1.6
N$19
  Top 0.305: U$13.P$8 44.34,41.6 43.5,42.44 R5.1
N$27
  Bottom 0.152: JP1.2
  Bottom 0.508: JP1.2 85.92,37.31 R13.2
N$29
  Top 0.152: U$15.G_A 41.51,31.53 41.34,31.7 41.34,33.2 41.16,33.38 R_I1.2
N$31
  Top 0.152: U$15.B_A 42.24,33.24 42.24,34 42.06,34.18 R_I1.3
N$32
  Top 0.152: R_I1.4 43.52,35.05 LED2.A
N$33
  Top 0.152: MCU1.60 25.75,43.25 26.11,43.61 26.8,43.61 28.02,44.84 R16.1
NRST  (via drill 0.35)
  Top 0.152: 18.5,33.89 U$12.P$2 14.02,33.88 13.7,33.57 v13.7,29.88 | 18.5,33.89 19.43,33.89 20.65,35.1 20.65,36.91 21.11,37.37 21.83,37.37 MCU1.7 | C10.1 18.46,33.85 18.5,33.89 | U$11.31 11.43,26.73 v11.5,26.8
  Bottom 0.152: v11.5,26.8 13.7,29 v13.7,29.88
  other vias: 18.46,32.65
RX  (via drill 0.35)
  Top 0.152: MCU1.17 23.75,28.75 v23.8,28.7 | U$11.15 27.92,7.64 v27.9,7.64
  Bottom 0.152: v23.8,28.7 23.8,9.84 26,7.64 v27.9,7.64
SCL
  Top 0.152: U$1.SCL 20.45,52.28 24.93,47.8 25.25,47.48 | 25.25,47.48 R12.2 | MCU1.61 25.25,47.48
SDA
  Top 0.152: U$1.SDA 17.91,50.88 R11.2 24.75,44.04 MCU1.62
TX  (via drill 0.35)
  Top 0.152: MCU1.16 21.85,28.75 v21.8,28.7
  Bottom 0.152: v21.8,28.7 21.8,9.95 U$11.12
  other vias: 24.13,7.62
V3.3  (via drill 0.35)
  Top 0.152: R11.1 27.07,45.26 27.07,45.72 | 27.07,45.72 R12.1 | 27.07,45.72 v25.81,45.72
  Top 0.305: MCU1.64 23.75,40.98 C8.1 | C8.1 23.16,40.39 MCU1.1 13.04,40.39 12.7,40.05 | C9.1 31.25,32.4 MCU1.32 31.25,29.75 30.7,29.2 | MCU1.48 32.65,40.89 C11.2 29.99,39.5 23.21,39.5 | MCU1.13 23.68,34.39 C2.2 24.88,34.43 25.01,34.3 | C14.1 42.72,37.12 43.15,36.7 | 43.15,36.7 U$13.P$5 | C4.1 12.7,40.05 | U$11.30 12.7,40.05 | 23.21,39.5 23.21,38.09 25.01,36.29 25.01,34.3 | 23.21,39.5 C8.1 | 25.01,34.3 C12.1 24.75,32.46 MCU1.19 24.75,29.55 25.1,29.2 30.7,29.2 | 30.7,29.2 32.6,29.2 v32.7,29.3 | v37.6,35.1 38.69,35.1 R_I1.5 39.34,35.66 42.11,35.66 43.15,36.7
  Bottom 0.152: U$10.PIN3 11.8,40.3 C4.1 | v25.81,45.72 23.21,43.12 C8.1
  Bottom 0.305: v32.7,29.3 33.25,29.85 37.14,29.85 37.6,30.31 v37.6,35.1
  other vias: 11.8,39.15 25.01,32.72 23.68,34.43 23.21,40.44 31.38,40.89 31.3,32.45 42.72,37.81
V5  (via drill 0.35)
  Top 0.305: R5.2 37.58,42.44 v37.54,42.4 37.54,48.82 U$1.24
  Bottom 0.152: U$9.P$2 3.28,40.84 6.7,40.84 U$10.PIN1 6.98,39.41 C3.1
  Bottom 0.305: C13.2 39.12,37.79 U$13.P$3 37.54,39.37 v37.54,42.4
  other vias: 6.72,39.15 38.94,37.97 5.7,70.4 6.7,70.4 7.6,70.4 8.6,70.4 9.5,70.4 9.5,69.4 8.6,69.4 7.6,69.4 6.7,69.4 5.7,69.4 5.6,41.8 6.5,41.8 7.4,41.8 8.3,41.8 9.2,41.8 9.2,40.9 9.2,39.9 8.3,39.9 8.3,40.9 28.4,68.9 29.4,68.9 29.4,69.8 28.4,69.8 28.4,70.7 29.4,70.7 79.2,20 80.2,20 79.2,19.1 80.2,19.1 81.2,19.1 82.2,18.2 81.2,18.2 80.2,18.2 79.2,18.2 61.9,20 61.9,19.1 62.8,19.1 63.8,19.1 64.7,19.1 64.7,18.1 63.8,18.1 62.8,18.1 61.9,18.1 64.7,20 63.8,20 62.8,20 5.6,39.9 5.6,40.9
  pour Top (no thermals): 0,38.1 10.16,38.1 10.16,42.34 10.1,42.4 0,42.4
  pour Bottom (no thermals): 5.08,38.1 10.16,38.1 10.16,71.12 5.08,71.12
  pour Bottom (no thermals): 5.08,38.1 10.16,38.1 10.16,42.34 10.1,42.4 5.08,42.4
  pour Top (no thermals): 5.08,71.12 99.06,71.12 99.06,68.58 5.08,68.58
  pour Top (no thermals): 99.06,20.32 48.26,20.32 48.26,17.78 99.06,17.78
  pour Top (no thermals): 100,71.1 100,18.72 99.06,17.78 88.9,17.78 88.9,35.56 97.66,35.56 97.66,60.56 94,64.22 94,71.1 93.98,71.12 99.98,71.12
  pour Bottom (no thermals): 27.94,55.88 27.94,71.12 29.88,71.12 29.9,71.1 29.9,55.9 29.88,55.88
  pour Bottom (no thermals): 60.96,20.32 60.96,17.78 73.66,17.78 73.66,20.32
  pour Bottom (no thermals): 78.74,20.32 78.74,17.78 93.98,17.78 93.98,20.32
V12  (via drill 0.35)
  other vias: 31.3,63 31.3,62 31.3,60 31.3,59 31.3,61 32.4,59 32.4,60 32.4,61 32.4,62 32.4,63 33.6,63 33.6,62 33.6,61 33.6,60 33.6,59 56.3,58.8 57.3,58.8 57.3,59.7 56.3,59.7 57.3,60.6 56.3,60.6 57.3,61.5 56.3,61.5 57.3,62.4 56.3,62.4 57.3,63.3 56.3,63.3 74.1,58.7 75.1,58.7 75.1,59.6 74.1,59.6 75.1,60.5 74.1,60.5 75.1,61.4 74.1,61.4 75.1,62.3 74.1,62.3 75.1,63.2 74.1,63.2 0.92,6.92 1.82,6.92 2.72,6.92 3.62,6.92 3.62,6.02 3.62,5.12 2.72,5.12 1.82,5.12 0.92,5.12 0.92,6.02 1.82,6.02 2.72,6.02
  pour Top (no thermals): 0,43.18 5.08,43.18 5.08,58.42 91.44,58.42 91.44,44.26 91.5,44.2 97.2,44.2 97.2,60.28 93.98,63.5 0,63.5
  pour Bottom (no thermals): 55.88,63.5 55.88,58.42 63.5,58.42 63.5,63.5
  pour Bottom (no thermals): 73.66,63.5 73.66,58.42 83.82,58.42 83.82,63.5
  pour Bottom (no thermals): 30.48,63.5 30.48,58.42 43.18,58.42 43.18,63.5
  pour Bottom (no thermals): 0,48.26 0,0 4.4,0 4.4,48.3 0.04,48.3
  pour Top (no thermals): 99.06,10.16 0,10.16 0,0 99.06,0

### Text on the board
tNames: 0.hayate | KRP | STM32F446RE/RC_CanBus_MatherBord